# Altium project LogicsOnly.PrjPcb
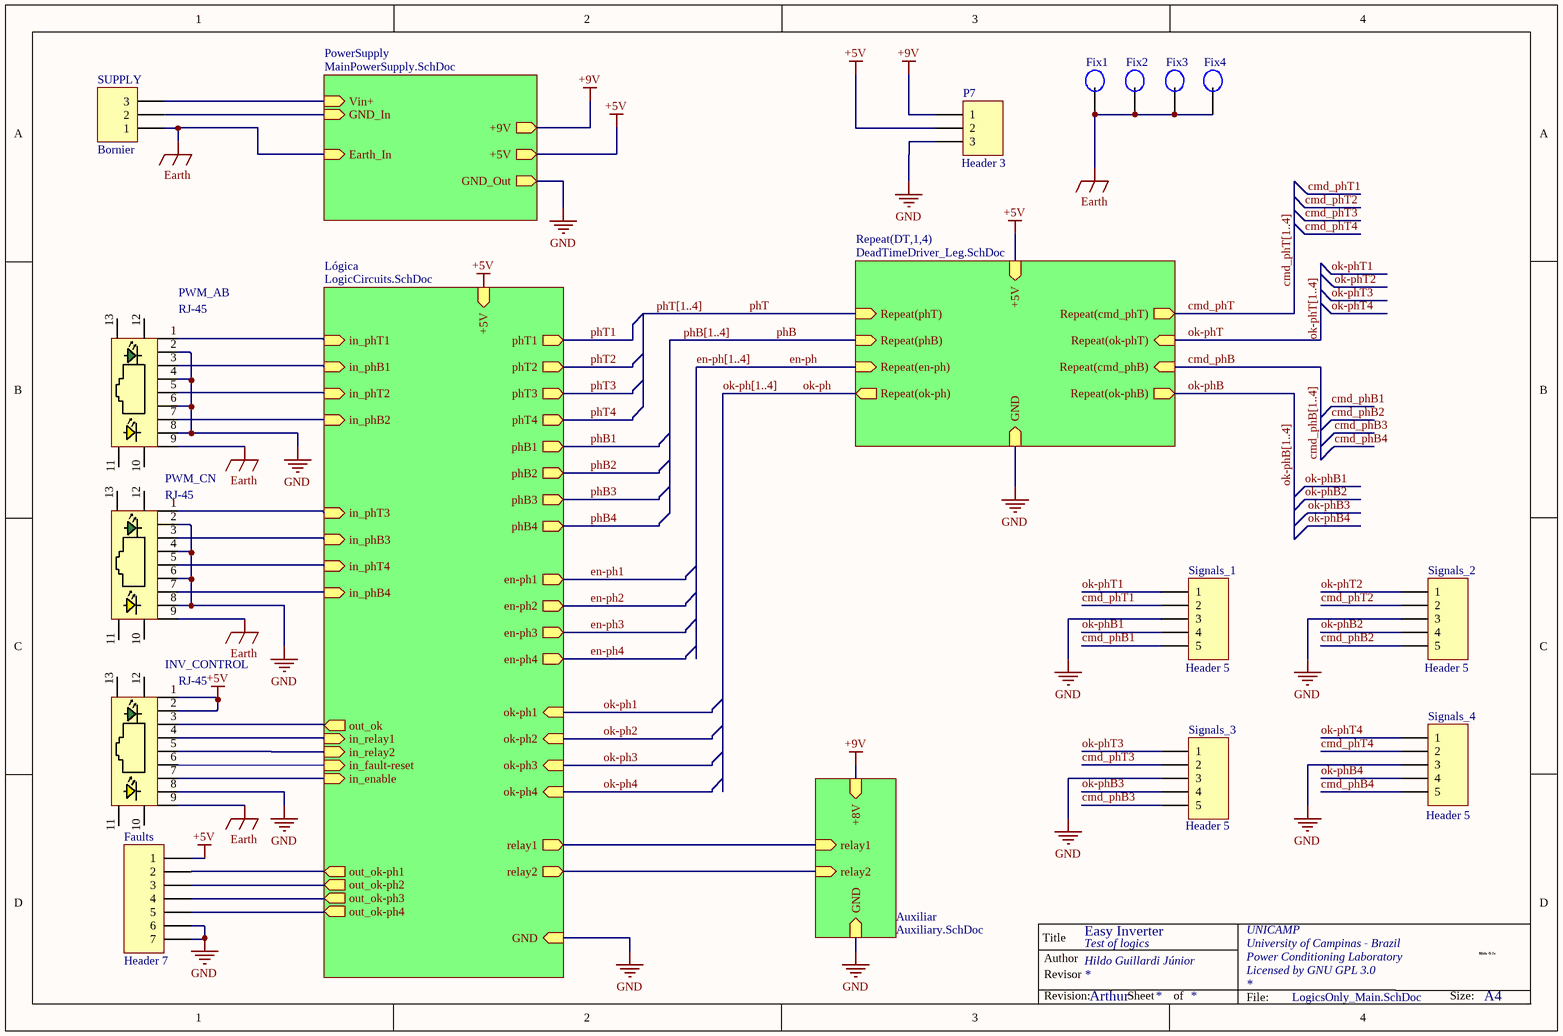
[diagram p0: LogicsOnly_Main.SchDoc]
2 sheets, 30 parts. Net scope: hierarchical (ports join the sheet entries above them; power ports are global).
Board file: LogicsOnly.PcbDoc
Sheets:
  LogicsOnly_Main.SchDoc
    Auxiliar = Auxiliary.SchDoc

## Sheet LogicsOnly_Main.SchDoc: Test of logics
size A4; Author: Hildo Guillardi Júnior; Organization: UNICAMP; Address1: University of Campinas - Brazil; Address2: Power Conditioning Laboratory; Address3: Licensed by GNU GPL 3.0; Revision: Arthur; ProjectName: Easy Inverter

### Parts
Faults  value Header 7
Fix1  (no value)  [Pino]
Fix2  (no value)  [Pino]
Fix3  (no value)  [Pino]
Fix4  (no value)  [Pino]
INV_CONTROL  value RJ-45  [RJ-45]
P7  value Header 3  [HDR1X3]
PWM_AB  value RJ-45  [RJ-45]
PWM_CN  value RJ-45  [RJ-45]
Signals_1  value Header 5  [HDR1X5]
Signals_2  value Header 5  [HDR1X5]
Signals_3  value Header 5  [HDR1X5]
Signals_4  value Header 5  [HDR1X5]
SUPPLY  value Bornier  [3 Pin  Borner]

### Sub-sheets
Auxiliar = Auxiliary.SchDoc: relay1 (in), relay2 (in), GND (in), +8V (in)
Lógica = LogicCircuits.SchDoc (file not in this document): +5V (in), GND (in), out_ok-ph1 (out), out_ok-ph2 (out), ok-ph1 (in), out_ok-ph3 (out), out_ok-ph4 (out), en-ph1 (out), en-ph2 (out), en-ph3 (out), en-ph4 (out), in_enable (in), in_fault-reset (in), in_relay1 (in), relay1 (out), relay2 (out), out_ok (out), ok-ph2 (in), ok-ph3 (in), ok-ph4 (in), phB1 (out), phB2 (out), phT1 (out), phT2 (out), phT3 (out), phB3 (out), phT4 (out), phB4 (out), in_phT1 (in), in_phB1 (in), in_phT2 (in), in_phB2 (in), in_phT4 (in), in_phB4 (in), in_phT3 (in), in_phB3 (in), in_relay2 (in)
PowerSupply = MainPowerSupply.SchDoc (file not in this document): Earth_In (in), +9V (out), +5V (out), GND_Out (out), GND_In (in), Vin+ (in)
Repeat(DT,1,4) = DeadTimeDriver_Leg.SchDoc (file not in this document): Repeat(ok-ph) (out), Repeat(cmd_phT) (out), Repeat(phB) (in), Repeat(ok-phT) (in), Repeat(phT) (in), GND (in), +5V (in), Repeat(ok-phB) (out), Repeat(en-ph) (in), Repeat(cmd_phB) (in)

### Nets
+5V: Faults.1 INV_CONTROL.1 INV_CONTROL.2 P7.2 ; sheet Lógica/+5V, sheet Repeat(DT,1,4)/+5V, sheet PowerSupply/+5V
+9V: P7.1 ; sheet Auxiliar/+8V, sheet PowerSupply/+9V
Earth: Fix1.0 Fix2.0 Fix3.0 Fix4.0 INV_CONTROL.9 PWM_AB.9 PWM_CN.9 SUPPLY.1 ; sheet PowerSupply/Earth_In
GND: Faults.6 Faults.7 INV_CONTROL.8 P7.3 PWM_AB.2 PWM_AB.4 PWM_AB.6 PWM_AB.8 PWM_CN.2 PWM_CN.4 PWM_CN.6 PWM_CN.8 Signals_1.3 Signals_2.3 Signals_3.3 Signals_4.3 ; sheet Lógica/GND, sheet Auxiliar/GND, sheet Repeat(DT,1,4)/GND, sheet PowerSupply/GND_Out
cmd_phB: sheet Repeat(DT,1,4)/Repeat(cmd_phB)
cmd_phB1: Signals_1.5
cmd_phB2: Signals_2.5
cmd_phB3: Signals_3.5
cmd_phB4: Signals_4.5
cmd_phT: sheet Repeat(DT,1,4)/Repeat(cmd_phT)
cmd_phT1: Signals_1.2
cmd_phT2: Signals_2.2
cmd_phT3: Signals_3.2
cmd_phT4: Signals_4.2
en-ph: sheet Repeat(DT,1,4)/Repeat(en-ph)
en-ph1: sheet Lógica/en-ph1
en-ph2: sheet Lógica/en-ph2
en-ph3: sheet Lógica/en-ph3
en-ph4: sheet Lógica/en-ph4
ok-ph: sheet Repeat(DT,1,4)/Repeat(ok-ph)
ok-ph1: sheet Lógica/ok-ph1
ok-ph2: sheet Lógica/ok-ph2
ok-ph3: sheet Lógica/ok-ph3
ok-ph4: sheet Lógica/ok-ph4
ok-phB: sheet Repeat(DT,1,4)/Repeat(ok-phB)
ok-phB1: Signals_1.4
ok-phB2: Signals_2.4
ok-phB3: Signals_3.4
ok-phB4: Signals_4.4
ok-phT: sheet Repeat(DT,1,4)/Repeat(ok-phT)
ok-phT1: Signals_1.1
ok-phT2: Signals_2.1
ok-phT3: Signals_3.1
ok-phT4: Signals_4.1
phB: sheet Repeat(DT,1,4)/Repeat(phB)
phB1: sheet Lógica/phB1
phB2: sheet Lógica/phB2
phB3: sheet Lógica/phB3
phB4: sheet Lógica/phB4
phT: sheet Repeat(DT,1,4)/Repeat(phT)
phT1: sheet Lógica/phT1
phT2: sheet Lógica/phT2
phT3: sheet Lógica/phT3
phT4: sheet Lógica/phT4
NetFaults_2: Faults.2 ; sheet Lógica/out_ok-ph1
NetFaults_3: Faults.3 ; sheet Lógica/out_ok-ph2
NetFaults_4: Faults.4 ; sheet Lógica/out_ok-ph3
NetFaults_5: Faults.5 ; sheet Lógica/out_ok-ph4
NetINV_CONTROL_3: INV_CONTROL.3 ; sheet Lógica/out_ok
NetINV_CONTROL_4: INV_CONTROL.4 ; sheet Lógica/in_relay1
NetINV_CONTROL_5: INV_CONTROL.5 ; sheet Lógica/in_relay2
NetINV_CONTROL_6: INV_CONTROL.6 ; sheet Lógica/in_fault-reset
NetINV_CONTROL_7: INV_CONTROL.7 ; sheet Lógica/in_enable
NetPWM_AB_1: PWM_AB.1 ; sheet Lógica/in_phT1
NetPWM_AB_3: PWM_AB.3 ; sheet Lógica/in_phB1
NetPWM_AB_5: PWM_AB.5 ; sheet Lógica/in_phT2
NetPWM_AB_7: PWM_AB.7 ; sheet Lógica/in_phB2
NetPWM_CN_1: PWM_CN.1 ; sheet Lógica/in_phT3
NetPWM_CN_3: PWM_CN.3 ; sheet Lógica/in_phB3
NetPWM_CN_5: PWM_CN.5 ; sheet Lógica/in_phT4
NetPWM_CN_7: PWM_CN.7 ; sheet Lógica/in_phB4
NetR2_1: sheet Lógica/relay1, sheet Auxiliar/relay1
NetR4_1: sheet Lógica/relay2, sheet Auxiliar/relay2
NetSUPPLY_2: SUPPLY.2 ; sheet PowerSupply/GND_In
NetSUPPLY_3: SUPPLY.3 ; sheet PowerSupply/Vin+

Not connected (* = marked no-connect by the designer): INV_CONTROL 10 11 12 13; PWM_AB 10 11 12 13; PWM_CN 10 11 12 13

### Buses and harness runs
bus cmd_phB[1..4]
bus cmd_phT[1..4]
bus en-ph[1..4]
bus ok-ph[1..4]
bus ok-phB[1..4]
bus ok-phT[1..4]
bus phB[1..4]
bus phT[1..4]

### Notes on the sheet
- Title
- Author
- Revisor
- Hildo G Jr
- Revision:
- Sheet
- of
- File:
- Size:
- A4
- HGJr

### Library data of the parts
Faults = Header 7: Header, 7-Pin
Fix1-Fix4 = Pino: Value: Pin; pn: 908-100; RM2X12MM 2701
INV_CONTROL PWM_AB PWM_CN = RJ-45: pn: A-2004-2-4-LPS-N-R
P7 = Header 3: Header, 3-Pin
Signals_1-Signals_4 = Header 5: Header, 5-Pin
SUPPLY = Header 3: Header, 3-Pin; pn: 1935174

## Sheet Auxiliary.SchDoc: Relays & auxiliary circuits
size A4; CheckedBy: Fellipe; Author: Hildo Guillardi Júnior; Organization: UNICAMP / LCEE; Address1: University of Campinas - Brazil; Address2: Power Conditioning Laboratory; Address3: Licensed by GNU GPL 3.0; ProjectName: Easy Inverter
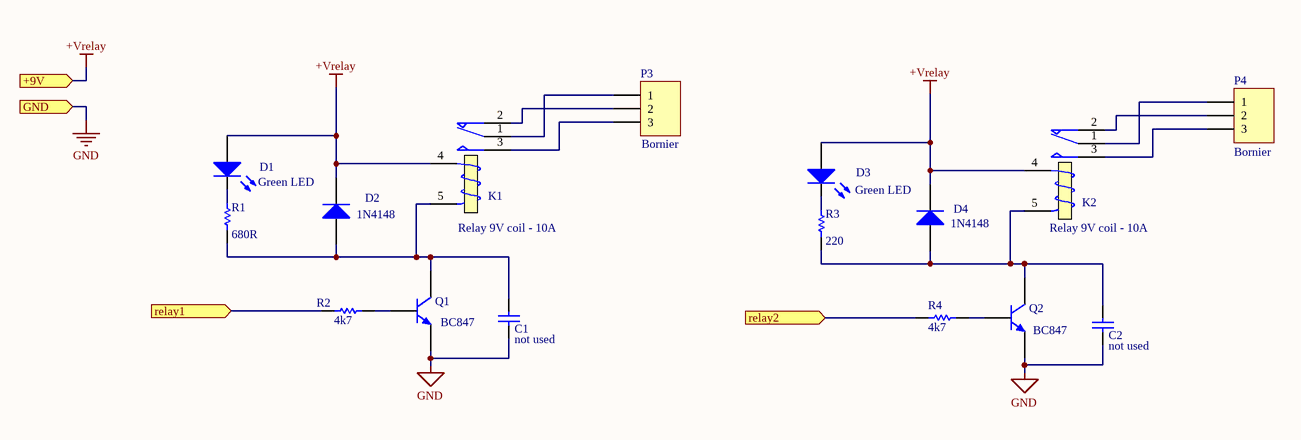
[diagram p1: Auxiliary.SchDoc]

### Parts
C1  value not used  [0805_W]
C2  value not used  [0805_W]
D1  value Green LED  [LED_0805]
D2  value 1N4148  [SOD-123]
D3  value Green LED  [LED_0805]
D4  value 1N4148  [SOD-123]
K1  value Relay 9V coil - 10A  [Relay - SPDT]
K2  value Relay 9V coil - 10A  [Relay - SPDT]
P3  value Bornier  [KK-3_G]
P4  value Bornier  [KK-3_G]
Q1  value BC847  [SOT-23-TT3_L]
Q2  value BC847  [SOT-23-TT3_L]
R1  value 680R  [0805_W]
R2  value 4k7  [0805_W]
R3  value 220  [0805_W]
R4  value 4k7  [0805_W]

### Ports
+9V (in), GND (in), relay1 (in), relay2 (in)

### Nets
+Vrelay: D1.1(A) D2.2(K) D3.1(A) D4.2(K) K1.4(T1) K2.4(T1) ; port +9V
GND: C1.1 C2.1 Q1.2(E) Q2.2(E) ; port GND
NetC1_2: C1.2 D2.1(A) K1.5(T2) Q1.3(C) R1.2
NetC2_2: C2.2 D4.1(A) K2.5(T2) Q2.3(C) R3.2
NetD1_2: D1.2(K) R1.1
NetD3_2: D3.2(K) R3.1
NetK1_1: K1.1(COM) P3.1
NetK1_2: K1.2(NC) P3.2
NetK1_3: K1.3(NO) P3.3
NetK2_1: K2.1(COM) P4.1
NetK2_2: K2.2(NC) P4.2
NetK2_3: K2.3(NO) P4.3
NetQ1_1: Q1.1(B) R2.2
NetQ2_1: Q2.1(B) R4.2
NetR2_1: R2.1 ; port relay1
NetR4_1: R4.1 ; port relay2

### Notes on the sheet
- Title
- Author
- Revisor
- Hildo G Jr
- Revision:
- Sheet
- of
- File:
- Size:
- A4
- HGJr

### Library data of the parts
C1 C2 = Cap: Capacitor
D1 D3 = LED0: Typical INFRARED GaAs LED; pn: SML-LXR85GC-TR
D2 D4 = Diode 1N4148: High Conductance Fast Diode; pn: 1N4148W-TP
K1 K2 = Relay: SPDT Relay; pn: G5LE-14-DC9
P3 P4 = Header 3: Header, 3-Pin; pn: 1935174
Q1 Q2 = BC847: NPN General-purpose Transistor; pn: BC847BLT1G
R1 R3 = Res_0805: Resistor; pn: RMCF0805JT680R
R2 R4 = Res1: Resistor; pn: RMCF0805JT4K70

## Nets that join several sheets
GND: LogicsOnly_Main (16 pins), Auxiliary (C1.1 C2.1 Q1.2 Q2.2)